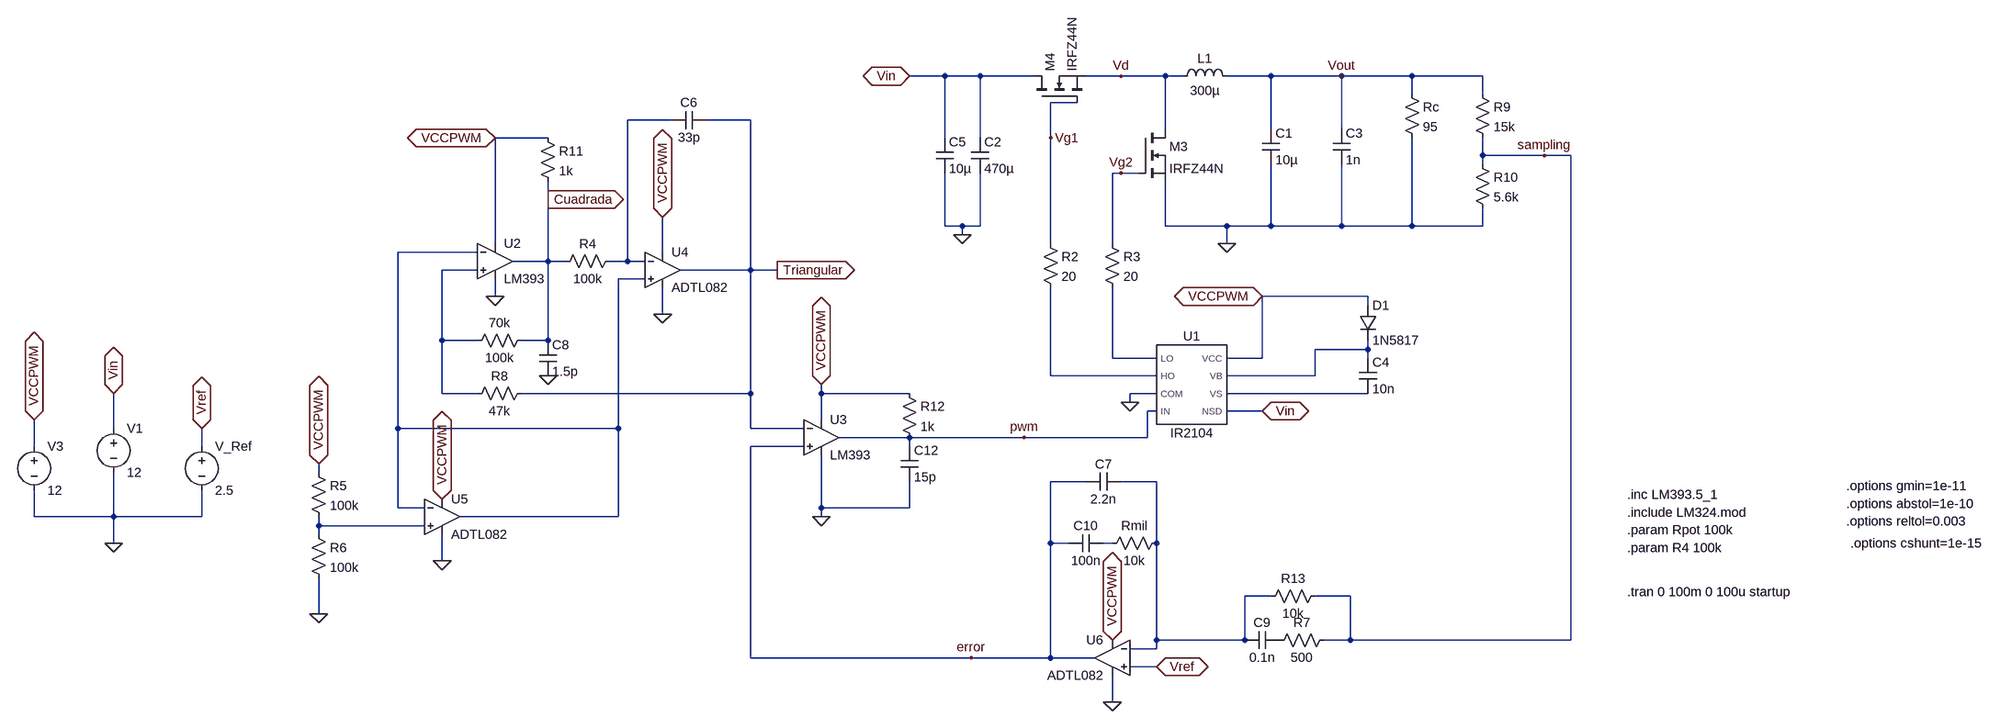
[diagram p0: schematic intento5_masrapidoybien.asc]
intento5_masrapidoybien.asc, the LTspice schematic file:
Version 4.1
SHEET 1 3160 1976
WIRE 48 -80 -16 -80
WIRE 112 -80 48 -80
WIRE 208 -80 112 -80
WIRE 368 -80 304 -80
WIRE 448 -80 368 -80
WIRE 480 -80 448 -80
WIRE 640 -80 560 -80
WIRE 768 -80 640 -80
WIRE 896 -80 768 -80
WIRE 1024 -80 896 -80
WIRE 896 -48 896 -80
WIRE 1024 -48 1024 -80
WIRE 288 -32 240 -32
WIRE -448 0 -528 0
WIRE -304 0 -384 0
WIRE 448 16 448 -80
WIRE 640 16 640 -80
WIRE 768 16 768 -80
WIRE -672 32 -768 32
WIRE 48 32 48 -80
WIRE 112 32 112 -80
WIRE 240 32 240 -32
WIRE 1024 64 1024 32
WIRE 1136 64 1024 64
WIRE 1184 64 1136 64
WIRE 1024 80 1024 64
WIRE 368 96 352 96
WIRE 400 96 368 96
WIRE -672 144 -672 112
WIRE 48 192 48 96
WIRE 80 192 48 192
WIRE 112 192 112 96
WIRE 112 192 80 192
WIRE 448 192 448 112
WIRE 560 192 448 192
WIRE 640 192 640 80
WIRE 640 192 560 192
WIRE 768 192 768 80
WIRE 768 192 640 192
WIRE 896 192 896 32
WIRE 896 192 768 192
WIRE 1024 192 1024 160
WIRE 1024 192 896 192
WIRE 80 208 80 192
WIRE -768 224 -768 32
WIRE 240 224 240 32
WIRE 352 224 352 96
WIRE 560 224 560 192
WIRE -800 240 -944 240
WIRE -464 240 -464 176
WIRE -672 256 -672 144
WIRE -672 256 -736 256
WIRE -640 256 -672 256
WIRE -528 256 -528 0
WIRE -528 256 -560 256
WIRE -496 256 -528 256
WIRE -800 272 -864 272
WIRE -304 272 -304 0
WIRE -304 272 -432 272
WIRE -256 272 -304 272
WIRE -496 288 -544 288
WIRE -768 320 -768 288
WIRE 816 320 624 320
WIRE 816 336 816 320
WIRE -464 352 -464 304
WIRE -864 400 -864 272
WIRE -800 400 -864 400
WIRE -672 400 -672 256
WIRE -672 400 -720 400
WIRE 816 416 816 400
WIRE 816 416 720 416
WIRE 352 432 352 304
WIRE 432 432 352 432
WIRE 624 432 624 320
WIRE 624 432 560 432
WIRE 816 432 816 416
WIRE 240 464 240 304
WIRE 432 464 240 464
WIRE 720 464 720 416
WIRE 720 464 560 464
WIRE -864 496 -864 400
WIRE -800 496 -864 496
WIRE -304 496 -304 272
WIRE -304 496 -720 496
WIRE -176 496 -176 480
WIRE -16 496 -176 496
WIRE 432 496 384 496
WIRE 816 496 560 496
WIRE 384 512 384 496
WIRE 432 528 416 528
WIRE 624 528 560 528
WIRE -176 544 -176 496
WIRE -1552 560 -1552 496
WIRE -944 560 -944 240
WIRE -544 560 -544 288
WIRE -544 560 -944 560
WIRE -304 560 -304 496
WIRE -208 560 -304 560
WIRE -16 576 -144 576
WIRE 192 576 -16 576
WIRE 416 576 416 528
WIRE 416 576 192 576
WIRE -1696 592 -1696 544
WIRE -1392 592 -1392 560
WIRE -208 592 -304 592
WIRE -16 592 -16 576
WIRE -1088 640 -1088 624
WIRE 304 656 240 656
WIRE 432 656 368 656
WIRE -944 704 -944 560
WIRE -896 704 -944 704
WIRE -176 704 -176 608
WIRE -16 704 -16 656
WIRE -16 704 -176 704
WIRE -1696 720 -1696 672
WIRE -1552 720 -1552 640
WIRE -1552 720 -1696 720
WIRE -1392 720 -1392 672
WIRE -1392 720 -1552 720
WIRE -544 720 -544 560
WIRE -544 720 -832 720
WIRE -176 720 -176 704
WIRE -1088 736 -1088 720
WIRE -896 736 -1088 736
WIRE -1088 752 -1088 736
WIRE -1552 768 -1552 720
WIRE 240 768 240 656
WIRE 272 768 240 768
WIRE 352 768 336 768
WIRE 432 768 432 656
WIRE -864 800 -864 752
WIRE 640 864 592 864
WIRE 784 864 720 864
WIRE -1088 896 -1088 832
WIRE 432 944 432 768
WIRE 592 944 592 864
WIRE 592 944 432 944
WIRE 784 944 784 864
WIRE 784 944 736 944
WIRE 1184 944 1184 64
WIRE 1184 944 784 944
WIRE 432 960 432 944
WIRE 432 960 384 960
WIRE -304 976 -304 592
WIRE 96 976 -304 976
WIRE 240 976 240 768
WIRE 240 976 96 976
WIRE 320 976 240 976
WIRE 432 992 384 992
WIRE 352 1056 352 1008
FLAG 368 -80 Vd
FLAG 768 -80 Vout
FLAG 384 512 0
FLAG -1088 896 0
FLAG -464 352 0
FLAG -864 800 0
FLAG -176 720 0
FLAG -768 320 0
FLAG -1696 544 VCCPWM
IOPIN -1696 544 BiDir
FLAG -768 32 VCCPWM
IOPIN -768 32 BiDir
FLAG -464 176 VCCPWM
IOPIN -464 176 BiDir
FLAG -864 688 VCCPWM
IOPIN -864 688 BiDir
FLAG -672 144 Cuadrada
IOPIN -672 144 Out
FLAG -256 272 Triangular
IOPIN -256 272 Out
FLAG -176 480 VCCPWM
IOPIN -176 480 BiDir
FLAG -1552 496 Vin
IOPIN -1552 496 BiDir
FLAG 560 224 0
FLAG 352 944 VCCPWM
IOPIN 352 944 BiDir
FLAG 352 1056 0
FLAG 624 320 VCCPWM
IOPIN 624 320 BiDir
FLAG -672 464 0
FLAG 240 32 Vg1
FLAG 368 96 Vg2
FLAG 96 976 error
FLAG 192 576 pwm
FLAG 1136 64 sampling
FLAG -1088 624 VCCPWM
IOPIN -1088 624 BiDir
FLAG -16 -80 Vin
IOPIN -16 -80 BiDir
FLAG -1392 560 Vref
IOPIN -1392 560 BiDir
FLAG -1552 768 0
FLAG 432 992 Vref
IOPIN 432 992 BiDir
FLAG 624 528 Vin
IOPIN 624 528 BiDir
FLAG 80 208 0
SYMBOL voltage -1552 544 R0
WINDOW 123 0 0 Left 0
WINDOW 39 0 0 Left 0
SYMATTR InstName V1
SYMATTR Value 12
SYMBOL ind 464 -64 R270
WINDOW 0 32 56 VTop 2
WINDOW 3 5 56 VBottom 2
SYMATTR InstName L1
SYMATTR Value 300µ
SYMBOL cap 624 16 R0
SYMATTR InstName C1
SYMATTR Value 10µ
SYMBOL nmos 400 16 R0
SYMATTR InstName M3
SYMATTR Value IRFZ44N
SYMBOL nmos 208 -32 R270
SYMATTR InstName M4
SYMATTR Value IRFZ44N
SYMBOL res 224 208 R0
SYMATTR InstName R2
SYMATTR Value 20
SYMBOL cap 96 32 R0
SYMATTR InstName C2
SYMATTR Value 470µ
SYMBOL cap 752 16 R0
SYMATTR InstName C3
SYMATTR Value 1n
SYMBOL res 336 208 R0
SYMATTR InstName R3
SYMATTR Value 20
SYMBOL diode 800 336 R0
SYMATTR InstName D1
SYMATTR Value 1N5817
SYMBOL cap 800 432 R0
SYMATTR InstName C4
SYMATTR Value 10n
SYMBOL IR2104 496 480 R0
SYMATTR InstName U1
SYMBOL cap 32 32 R0
SYMATTR InstName C5
SYMATTR Value 10µ
SYMBOL res -544 240 R90
WINDOW 0 0 56 VBottom 2
WINDOW 3 32 56 VTop 2
SYMATTR InstName R4
SYMATTR Value 100k
SYMBOL res -1104 624 R0
SYMATTR InstName R5
SYMATTR Value 100k
SYMBOL res -1104 736 R0
SYMATTR InstName R6
SYMATTR Value 100k
SYMBOL res -704 384 R90
WINDOW 0 0 56 VBottom 2
WINDOW 3 32 56 VTop 2
SYMATTR InstName 70k
SYMATTR Value 100k
SYMBOL res -704 480 R90
WINDOW 0 0 56 VBottom 2
WINDOW 3 32 56 VTop 2
SYMATTR InstName R8
SYMATTR Value 47k
SYMBOL cap -384 -16 R90
WINDOW 0 0 32 VBottom 2
WINDOW 3 32 32 VTop 2
SYMATTR InstName C6
SYMATTR Value 33p
SYMBOL res -688 16 R0
SYMATTR InstName R11
SYMATTR Value 1k
SYMBOL res -32 480 R0
SYMATTR InstName R12
SYMATTR Value 1k
SYMBOL OpAmps\\opamp2 -768 192 R0
SYMATTR InstName U2
SYMATTR Value LM393
SYMBOL OpAmps\\opamp2 -176 512 R0
SYMATTR InstName U3
SYMATTR Value LM393
SYMBOL res 1008 -64 R0
SYMATTR InstName R9
SYMATTR Value 15k
SYMBOL res 1008 64 R0
SYMATTR InstName R10
SYMATTR Value 5.6k
SYMBOL OpAmps\\ADTL082 -464 208 R0
SYMATTR InstName U4
SYMBOL OpAmps\\ADTL082 -864 656 R0
SYMATTR InstName U5
SYMBOL voltage -1696 576 R0
WINDOW 123 0 0 Left 0
WINDOW 39 0 0 Left 0
SYMATTR InstName V3
SYMATTR Value 12
SYMBOL OpAmps\\ADTL082 352 912 M0
SYMATTR InstName U6
SYMBOL res 336 784 R270
WINDOW 0 32 56 VTop 2
WINDOW 3 0 56 VBottom 2
SYMATTR InstName Rmil
SYMATTR Value 10k
SYMBOL voltage -1392 576 R0
WINDOW 123 0 0 Left 0
WINDOW 39 0 0 Left 0
SYMATTR InstName V_Ref
SYMATTR Value 2.5
SYMBOL res 880 -64 R0
SYMATTR InstName Rc
SYMATTR Value 95
SYMBOL res 640 960 R270
WINDOW 0 32 56 VTop 2
WINDOW 3 0 56 VBottom 2
SYMATTR InstName R7
SYMATTR Value 500
SYMBOL cap 592 960 R270
WINDOW 0 32 32 VTop 2
WINDOW 3 0 32 VBottom 2
SYMATTR InstName C9
SYMATTR Value 0.1n
SYMBOL res 624 880 R270
WINDOW 0 32 56 VTop 2
WINDOW 3 0 56 VBottom 2
SYMATTR InstName R13
SYMATTR Value 10k
SYMBOL cap 272 784 R270
WINDOW 0 32 32 VTop 2
WINDOW 3 0 32 VBottom 2
SYMATTR InstName C10
SYMATTR Value 100n
SYMBOL cap 304 672 R270
WINDOW 0 32 32 VTop 2
WINDOW 3 0 32 VBottom 2
SYMATTR InstName C7
SYMATTR Value 2.2n
SYMBOL cap -688 400 R0
SYMATTR InstName C8
SYMATTR Value 1.5p
SYMBOL cap -32 592 R0
SYMATTR InstName C12
SYMATTR Value 15p
TEXT 1760 856 Left 2 !.tran 0 100m 0 100u startup
TEXT 1760 744 Left 2 !.param Rpot 100k
TEXT 1760 680 Left 2 !.inc LM393.5_1
TEXT 1760 776 Left 2 !.param R4 100k
TEXT 1760 712 Left 2 !.include LM324.mod
TEXT 2232 664 Left 2 !.options gmin=1e-11
TEXT 2232 696 Left 2 !.options abstol=1e-10
TEXT 2232 728 Left 2 !.options reltol=0.003
TEXT 2240 768 Left 2 !.options cshunt=1e-15

The netlist it stands for:
* intento5_masrapidoybien.asc
V1 Vin 0 12
L1 Vd Vout 300µ
C1 Vout 0 10µ
M3 Vd Vg2 0 0 IRFZ44N
M4 Vin Vg1 Vd Vd IRFZ44N
R2 Vg1 N006 20
C2 Vin 0 470µ
C3 Vout 0 1n
R3 Vg2 N005 20
D1 VCCPWM N004 1N5817
C4 N004 N007 10n
X§U1 N005 N006 0 pwm VCCPWM N004 N007 Vin IR2104  ; pins LO HO COM IN VCC VB VS NSD
C5 Vin 0 10µ
R4 N001 Cuadrada 100k
R5 VCCPWM N009 100k
R6 N009 0 100k
R§70k Cuadrada N003 100k
R8 Triangular N003 47k
C6 Triangular N001 33p
R11 VCCPWM Cuadrada 1k
R12 VCCPWM pwm 1k
X§U2 N003 N002 VCCPWM 0 Cuadrada LM393  ; pins In+ In- V+ V- OUT
X§U3 error Triangular VCCPWM 0 pwm LM393  ; pins In+ In- V+ V- OUT
R9 Vout sampling 15k
R10 sampling 0 5.6k
X§U4 N002 N001 VCCPWM 0 Triangular ADTL082  ; pins In+ In- V+ V- OUT
X§U5 N009 N002 VCCPWM 0 N002 ADTL082  ; pins In+ In- V+ V- OUT
V3 VCCPWM 0 12
X§U6 Vref N008 VCCPWM 0 error ADTL082  ; pins In+ In- V+ V- OUT
Rmil N010 N008 10k
V_Ref Vref 0 2.5
Rc Vout 0 95
R7 P001 sampling 500
C9 N008 P001 0.1n
R13 N008 sampling 10k
C10 error N010 100n
C7 error N008 2.2n
C8 Cuadrada 0 1.5p
C12 pwm 0 15p
.model D D
.lib standard.dio
.model NMOS NMOS
.model PMOS PMOS
.lib standard.mos
.tran 0 100m 0 100u startup
.param Rpot 100k
.inc LM393.5_1
.param R4 100k
.include LM324.mod
.options gmin=1e-11
.options abstol=1e-10
.options reltol=0.003
.options cshunt=1e-15
.lib C:\Users\Gonzalo\Documents\GitHub\Circuitos II\1CTDC\CP5_buck_pwm\Buck y PWM\IR2104.lib
.lib ADI.lib
.backanno
.end